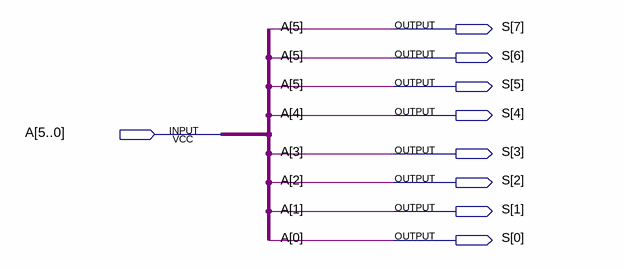
[diagram p0: schematic sheet]
// Quartus schematic 6to8bit.bdf as structural Verilog: 0 symbols, 9 pins
module \6to8bit  (
  input  [5:0] A,
  output [7:0] S
);


  assign S = {{3{A[5]}}, A[4:0]};
endmodule
